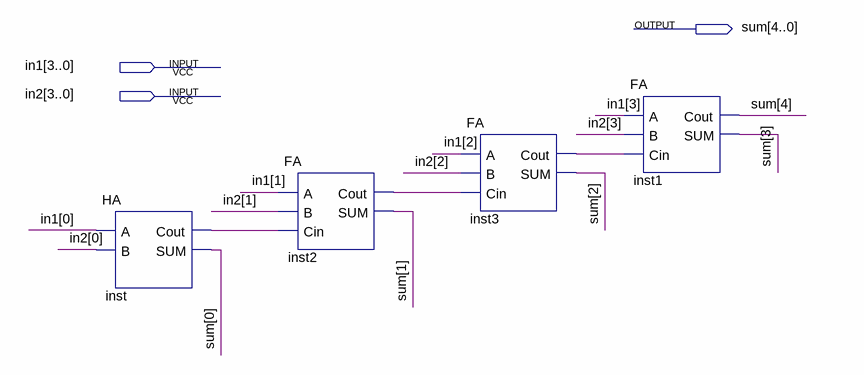
[diagram p0: schematic sheet]
// Quartus schematic 4bit_RCA.bdf as structural Verilog: 4 symbols, 3 pins
module \4bit_RCA  (
  input  [3:0] in1,
  input  [3:0] in2,
  output [4:0] sum
);

  wire inst2_cout, inst3_cout, inst_cout;

  HA inst (.A(in1[0]), .B(in2[0]), .Cout(inst_cout), .SUM(sum[0]));
  FA inst2 (.A(in1[1]), .B(in2[1]), .Cin(inst_cout), .Cout(inst2_cout), .SUM(sum[1]));
  FA inst3 (.A(in1[2]), .B(in2[2]), .Cin(inst2_cout), .Cout(inst3_cout), .SUM(sum[2]));
  FA inst1 (.A(in1[3]), .B(in2[3]), .Cin(inst3_cout), .Cout(sum[4]), .SUM(sum[3]));
endmodule
